# Altium schematic sheet CX3_Camera_Layout.SchDoc
size 508 x 508 mm
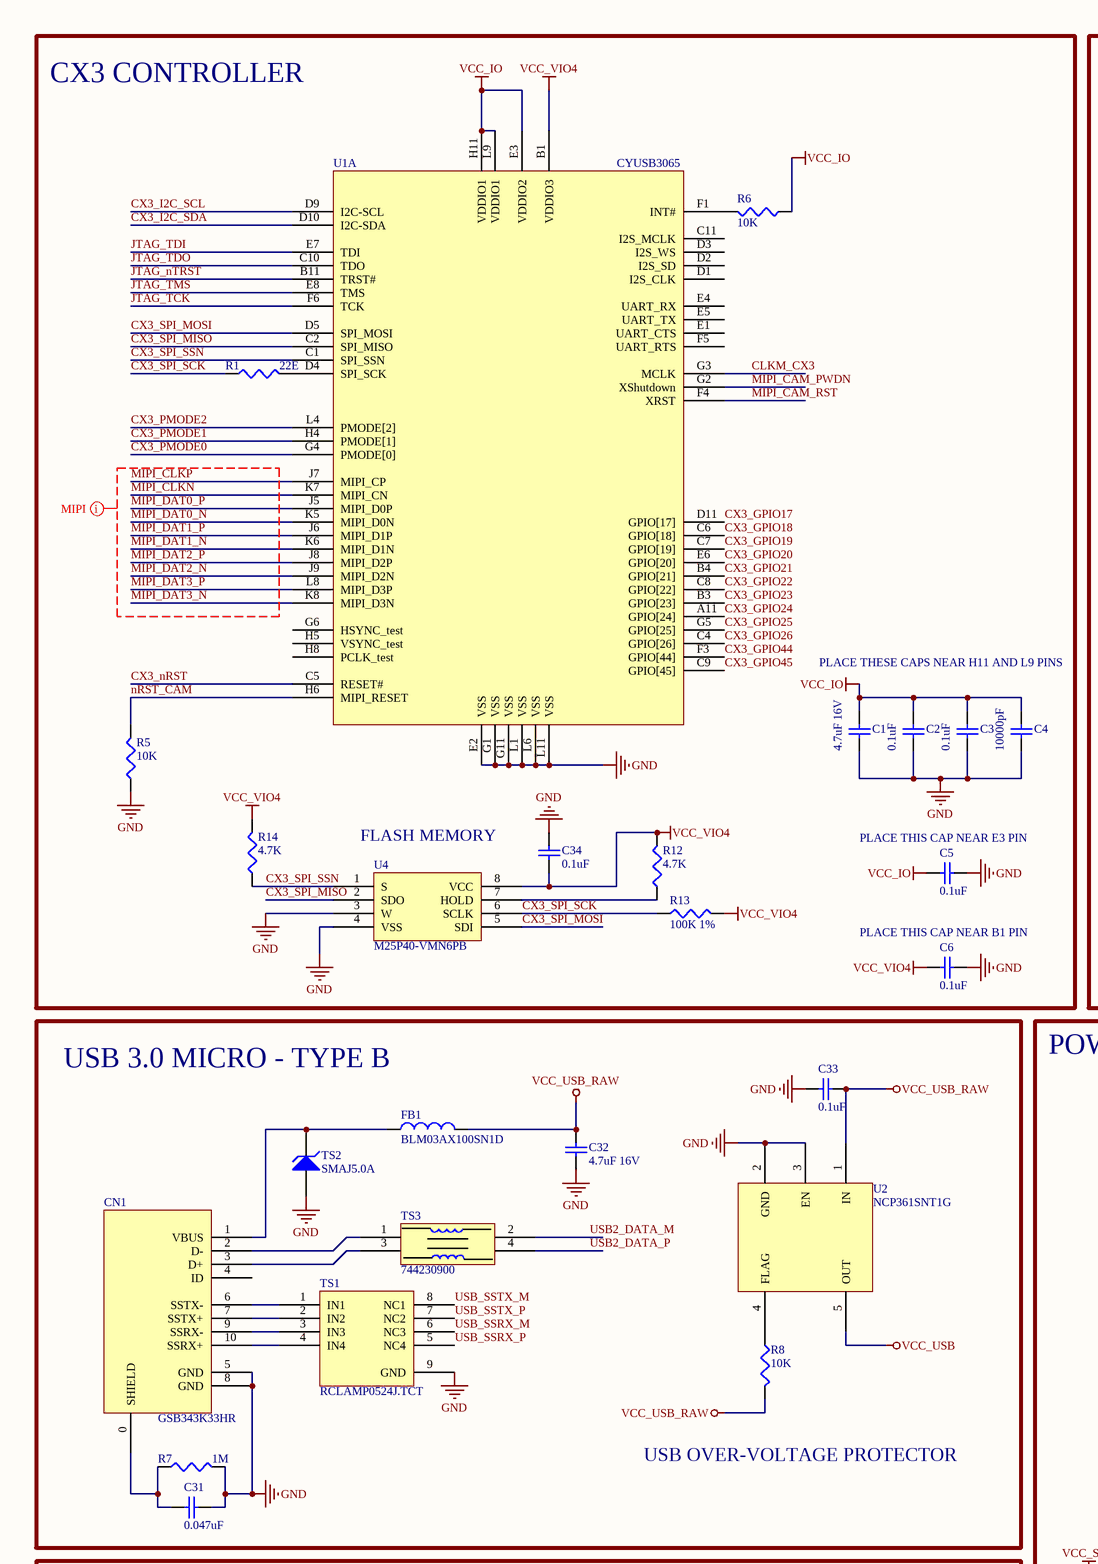
[diagram p0: CX3_Camera_Layout.SchDoc, top left]
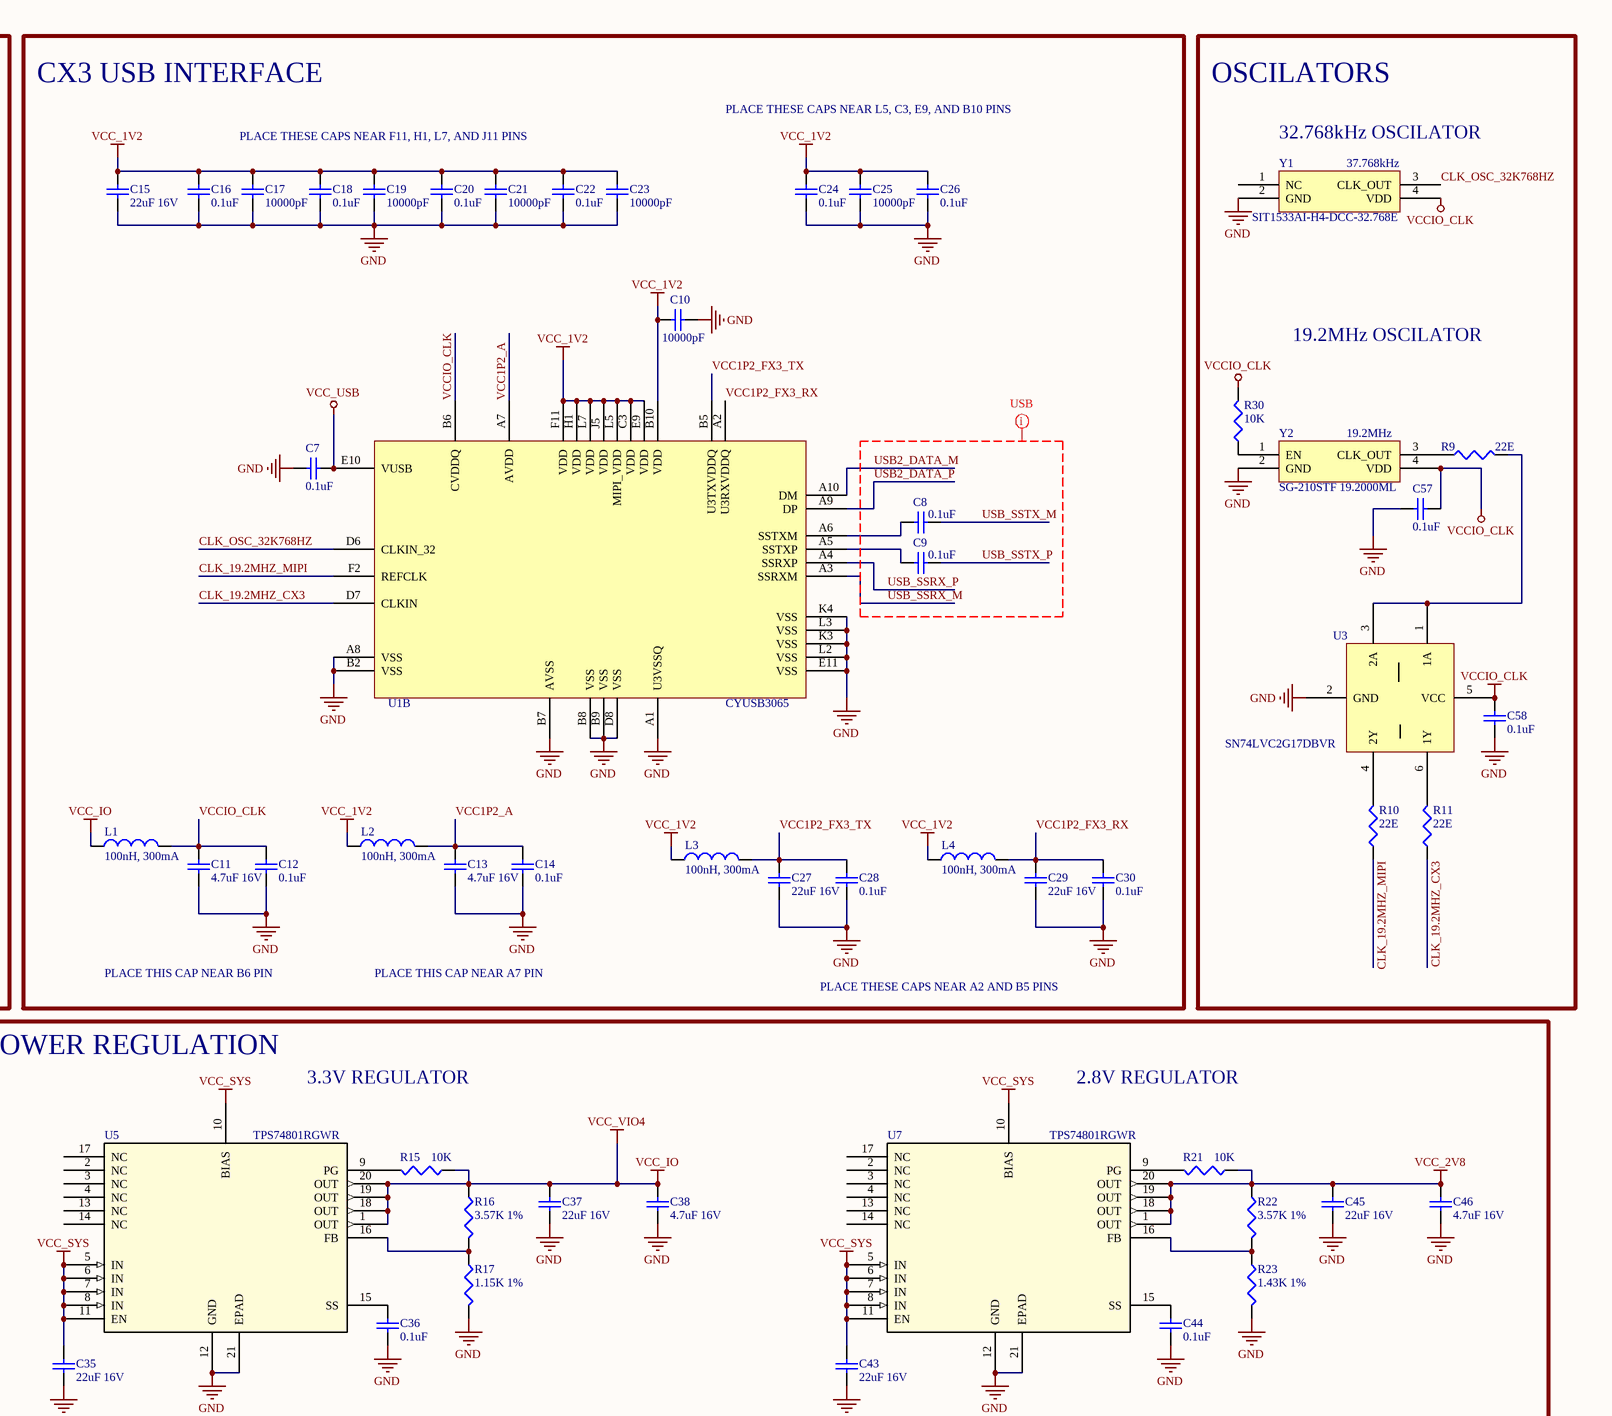
[diagram p1: CX3_Camera_Layout.SchDoc, top right]
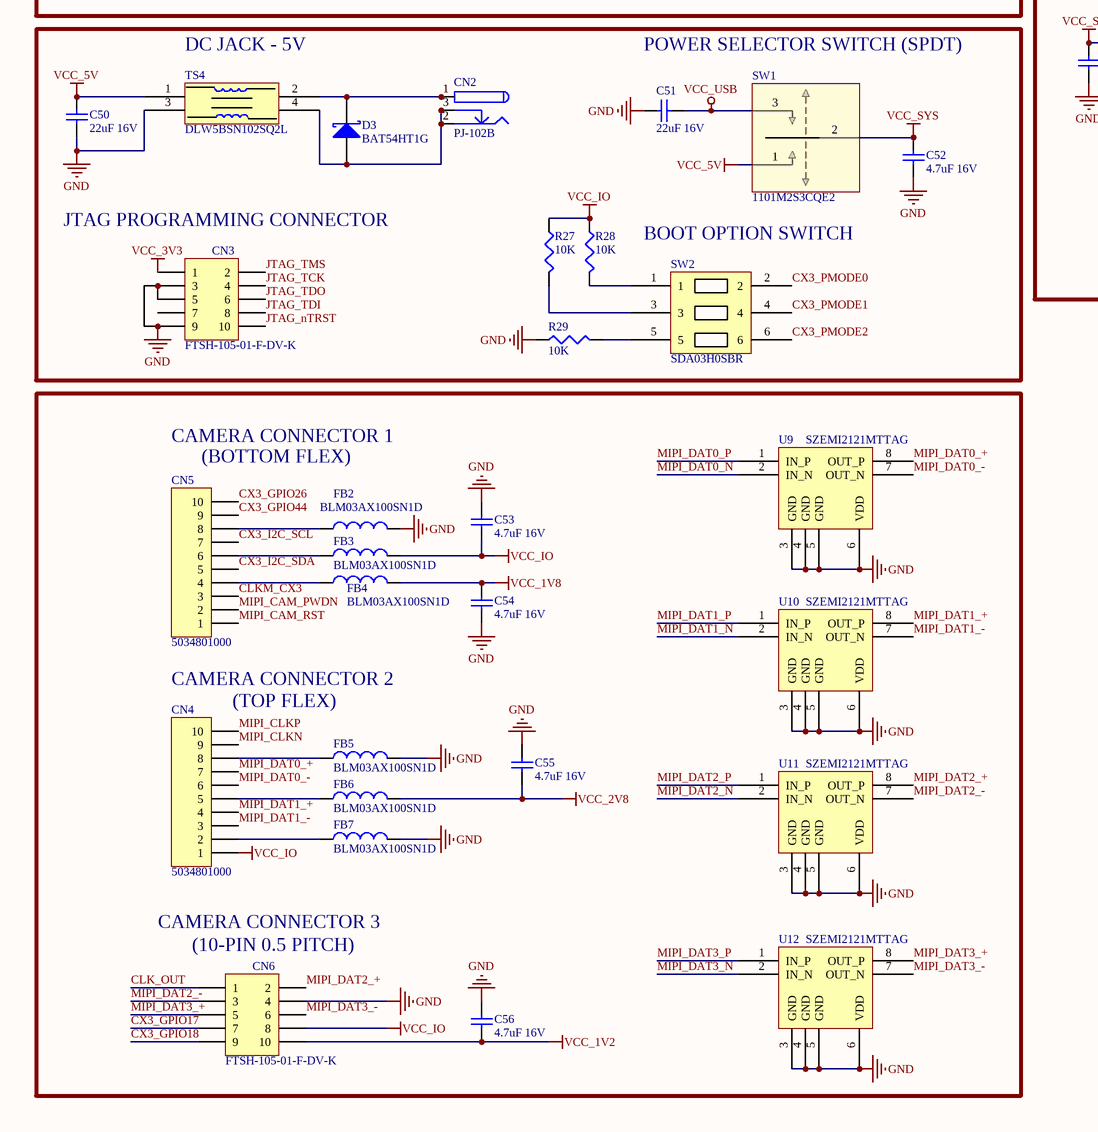
[diagram p2: CX3_Camera_Layout.SchDoc, bottom left]
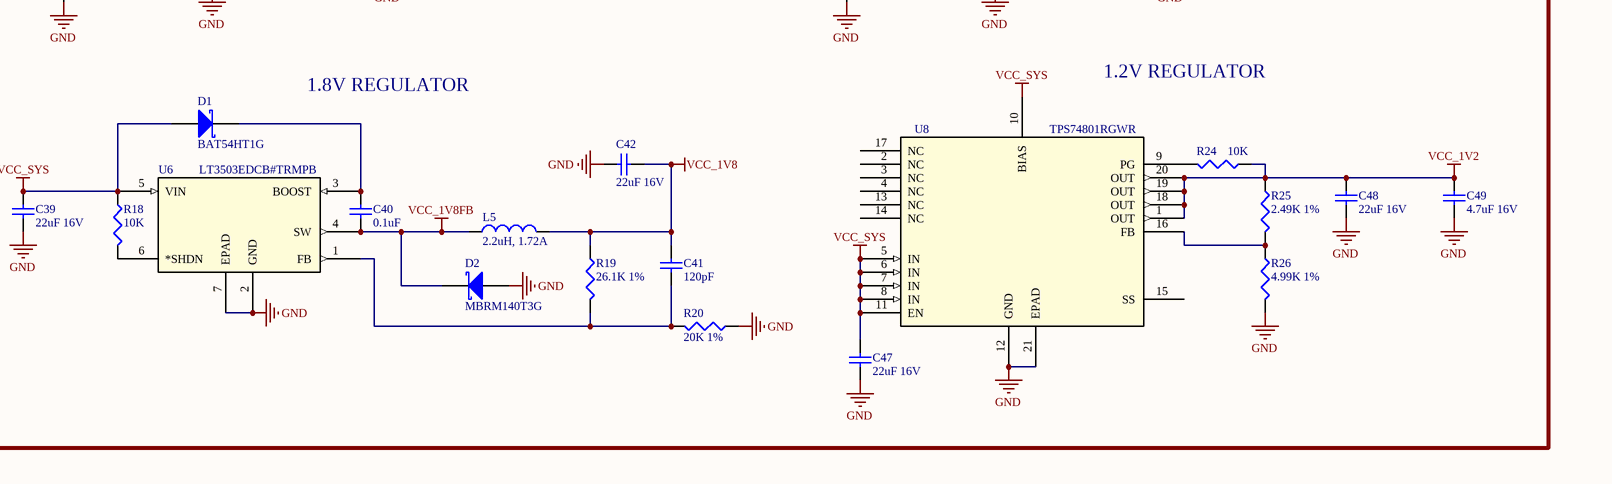
[diagram p3: CX3_Camera_Layout.SchDoc, bottom right]

## Parts
C1  4.7uF 16V  [1608[0603]]
C2  0.1uF  [0402]
C3  0.1uF  [0402]
C4  10000pF  [0402]
C5  0.1uF  [0402]
C6  0.1uF  [0402]
C7  0.1uF  [0402]
C8  0.1uF  [0402]
C9  0.1uF  [0402]
C10  10000pF  [0402]
C11  4.7uF 16V  [1608[0603]]
C12  0.1uF  [0402]
C13  4.7uF 16V  [1608[0603]]
C14  0.1uF  [0402]
C15  22uF 16V  [1608[0603]]
C16  0.1uF  [0402]
C17  10000pF  [0402]
C18  0.1uF  [0402]
C19  10000pF  [0402]
C20  0.1uF  [0402]
C21  10000pF  [0402]
C22  0.1uF  [0402]
C23  10000pF  [0402]
C24  0.1uF  [0402]
C25  10000pF  [0402]
C26  0.1uF  [0402]
C27  22uF 16V  [1608[0603]]
C28  0.1uF  [0402]
C29  22uF 16V  [1608[0603]]
C30  0.1uF  [0402]
C31  0.047uF  [C1210]
C32  4.7uF 16V  [1608[0603]]
C33  0.1uF  [0402]
C34  0.1uF  [0402]
C35  22uF 16V  [1608[0603]]
C36  0.1uF  [0402]
C37  22uF 16V  [1608[0603]]
C38  4.7uF 16V  [1608[0603]]
C39  22uF 16V  [1608[0603]]
C40  0.1uF  [0402]
C41  120pF  [0402]
C42  22uF 16V  [1608[0603]]
C43  22uF 16V  [1608[0603]]
C44  0.1uF  [0402]
C45  22uF 16V  [1608[0603]]
C46  4.7uF 16V  [1608[0603]]
C47  22uF 16V  [1608[0603]]
C48  22uF 16V  [1608[0603]]
C49  4.7uF 16V  [1608[0603]]
C50  22uF 16V  [1608[0603]]
C51  22uF 16V  [C0805]
C52  4.7uF 16V  [C0805]
C53  4.7uF 16V  [1608[0603]]
C54  4.7uF 16V  [1608[0603]]
C55  4.7uF 16V  [1608[0603]]
C56  4.7uF 16V  [1608[0603]]
C57  0.1uF  [0402]
C58  0.1uF  [0402]
CN1  GSB343K33HR  [USB3MicroB]
CN2  PJ-102B  [KLD-0202]
CN3  FTSH-105-01-F-DV-K  [FTSH-105-01-F-DV-K]
CN4  5034801000  [5034801000]
CN5  5034801000  [5034801000]
CN6  FTSH-105-01-F-DV-K  [FTSH-105-01-F-DV-K]
D1  BAT54HT1G  [SOD-323]
D2  MBRM140T3G  [DO-216AA]
D3  BAT54HT1G  [DO-214AC]
FB1  BLM03AX100SN1D  [1608[0603]]
FB2  BLM03AX100SN1D  [0603]
FB3  BLM03AX100SN1D  [0603]
FB4  BLM03AX100SN1D  [0603]
FB5  BLM03AX100SN1D  [0603]
FB6  BLM03AX100SN1D  [0603]
FB7  BLM03AX100SN1D  [0603]
L1  100nH, 300mA  [0603]
L2  100nH, 300mA  [0603]
L3  100nH, 300mA  [0603]
L4  100nH, 300mA  [0603]
L5  2.2uH, 1.72A  [0603]
R1  22E  [0402]
R5  10K  [0402]
R6  10K  [0402]
R7  1M  [0402]
R8  10K  [0402]
R9  22E  [J1-0603]
R10  22E  [0402]
R11  22E  [0402]
R12  4.7K  [0402]
R13  100K 1%  [0402]
R14  4.7K  [0402]
R15  10K  [0402]
R16  3.57K 1%  [0402]
R17  1.15K 1%  [0402]
R18  10K  [0402]
R19  26.1K 1%  [0402]
R20  20K 1%  [0402]
R21  10K  [0402]
R22  3.57K 1%  [0402]
R23  1.43K 1%  [0402]
R24  10K  [0402]
R25  2.49K 1%  [0402]
R26  4.99K 1%  [0402]
R27  10K  [0402]
R28  10K  [0402]
R29  10K  [0402]
R30  10K  [0402]
SW1  1101M2S3CQE2  [1101M2S3CQE2]
SW2  SDA03H0SBR  [SDA03H0SBR]
TS1  RCLAMP0524J.TCT  [RCLAMP0524J]
TS2  SMAJ5.0A  [DO-214AC]
TS3  744230900
TS4  DLW5BSN102SQ2L  [SRF0504-102Y]
U1  CYUSB3065  [BGA121C80P11X11_1000X1000X170B30N]  (parts A,B of 2)
U2  NCP361SNT1G  [SOT-23-5]
U3  SN74LVC2G17DBVR  [SOT-23_A_N]
U4  M25P40-VMN6PB  [SO8_M]
U5  TPS74801RGWR  [RGW20_3P15X3P15]
U6  LT3503EDCB#TRMPB  [DFN-6_DCB]
U7  TPS74801RGWR  [RGW20_3P15X3P15]
U8  TPS74801RGWR  [RGW20_3P15X3P15]
U9  SZEMI2121MTTAG  [SZEMI2121MTTAG]
U10  SZEMI2121MTTAG  [SZEMI2121MTTAG]
U11  SZEMI2121MTTAG  [SZEMI2121MTTAG]
U12  SZEMI2121MTTAG  [SZEMI2121MTTAG]
Y1  SIT1533AI-H4-DCC-32.768E  value 37.768kHz  [SiT1533]
Y2  SG-210STF 19.2000ML  value 19.2MHz  [SG5032]

## Blocks framed on the sheet
CX3 CONTROLLER: C1-C6 C34 R1 R5 R6 R12-R14 U1 U4
CX3 USB INTERFACE: C7-C30 L1-L4 U1
OSCILATORS: C57 C58 R9-R11 R30 U3 Y1 Y2
USB 3.0 MICRO - TYPE B: C31-C33 CN1 FB1 R7 R8 TS1-TS3 U2
POWER REGULATION: C35-C49 D1 D2 L5 R15-R26 U5-U8

## Nets
GND: C1.2 C2.2 C3.2 C4.2 C5.2 C6.2 C7.1 C10.2 C11.1 C12.2 C13.1 C14.2 C15.1 C16.1 C17.1 C18.1 C19.1 C20.1 C21.1 C22.1 C23.1 C24.1 C25.1 C26.1 C27.1 C28.2 C29.1 C30.2 C31.2 C32.1 C33.1 C34.2 C35.1 C36.1 C37.1 C38.1 C39.2 C42.1 C43.1 C44.1 C45.1 C46.1 C47.1 C48.1 C49.1 C50.1 C51.1 C52.1 C53.2 C54.1 C55.2 C56.2 C57.1 C58.2 CN1.5(GND) CN1.8(GND) CN3.3 CN3.5 CN3.9 CN6.4 D2.2(A) FB2.2 FB5.2 FB7.2 R5.1 R7.2 R17.2 R20.1 R23.2 R26.2 R29.1 TS1.9(GND) TS2.1(A) TS4.3 U1.A1(U3VSSQ) U1.A8(VSS) U1.B2(VSS) U1.B7(AVSS) U1.B8(VSS) U1.B9(VSS) U1.D8(VSS) U1.E2(VSS) U1.E11(VSS) U1.G1(VSS) U1.G11(VSS) U1.K3(VSS) U1.K4(VSS) U1.L1(VSS) U1.L2(VSS) U1.L3(VSS) U1.L6(VSS) U1.L11(VSS) U2.2(GND) U2.3(EN) U3.2(GND) U4.3(W) U4.4(VSS) U5.12(GND) U5.21(EPAD) U6.2(GND) U6.7(EPAD) U7.12(GND) U7.21(EPAD) U8.12(GND) U8.21(EPAD) U9.3(GND) U9.4(GND) U9.5(GND) U9.6(VDD) U10.3(GND) U10.4(GND) U10.5(GND) U10.6(VDD) U11.3(GND) U11.4(GND) U11.5(GND) U11.6(VDD) U12.3(GND) U12.4(GND) U12.5(GND) U12.6(VDD) Y1.2(GND) Y2.2(GND)
VCC_1V2: C10.1 C15.2 C16.2 C17.2 C18.2 C19.2 C20.2 C21.2 C22.2 C23.2 C24.2 C25.2 C26.2 C48.2 C49.2 C56.1 CN6.10 L2.1 L3.1 L4.1 R24.1 R25.1 U1.B10(VDD) U1.C3(VDD) U1.E9(VDD) U1.F11(VDD) U1.H1(VDD) U1.J5(VDD) U1.L5(MIPI_VDD) U1.L7(VDD) U8.1(OUT) U8.18(OUT) U8.19(OUT) U8.20(OUT)
VCC_1V8: C41.1 C42.2 C54.2 FB4.2 L5.2 R19.1
VCC_1V8FB: C40.2 D2.1(K) L5.1 U6.4(SW)
VCC_2V8: C45.2 C46.2 C55.1 FB6.2 R21.1 R22.1 U7.1(OUT) U7.18(OUT) U7.19(OUT) U7.20(OUT)
VCC_3V3: CN3.1
VCC_5V: C50.2 SW1.1 TS4.1
VCC_IO: C1.1 C2.1 C3.1 C4.1 C5.1 C6.1 C34.1 C37.2 C38.2 C53.1 CN4.1 CN6.8 FB3.2 L1.1 R6.1 R12.2 R13.2 R14.2 R15.1 R16.1 R27.1 R28.1 U1.B1(VDDIO3) U1.E3(VDDIO2) U1.H11(VDDIO1) U1.L9(VDDIO1) U4.8(VCC) U5.1(OUT) U5.18(OUT) U5.19(OUT) U5.20(OUT)  [also labelled VCC_VIO4]
VCC_SYS: C35.2 C39.1 C43.2 C47.2 C52.2 D1.2(A) R18.1 SW1.2 U5.5(IN) U5.6(IN) U5.7(IN) U5.8(IN) U5.10(BIAS) U5.11(EN) U6.5(VIN) U7.5(IN) U7.6(IN) U7.7(IN) U7.8(IN) U7.10(BIAS) U7.11(EN) U8.5(IN) U8.6(IN) U8.7(IN) U8.8(IN) U8.10(BIAS) U8.11(EN)
VCC_USB: C7.2 C51.2 SW1.3 U1.E10(VUSB) U2.5(OUT)
VCC_USB_RAW: C32.2 C33.2 FB1.2 R8.2 U2.1(IN)
VCCIO_CLK: C11.2 C12.1 C57.2 C58.1 L1.2 R30.2 U1.B6(CVDDQ) U3.5(VCC) Y1.4(VDD) Y2.4(VDD)
CLK_19.2MHZ_CX3: R11.1 U1.D7(CLKIN)
CLK_19.2MHZ_MIPI: R10.1 U1.F2(REFCLK)
CLK_OSC_32K768HZ: U1.D6(CLKIN_32) Y1.3(CLK_OUT)
CLK_OUT: CN6.1
CLKM_CX3: CN5.3 U1.G3(MCLK)
CX3_GPIO17: CN6.7 U1.D11(GPIO[17])
CX3_GPIO18: CN6.9 U1.C6(GPIO[18])
CX3_GPIO19: U1.C7(GPIO[19])
CX3_GPIO20: U1.E6(GPIO[20])
CX3_GPIO21: U1.B4(GPIO[21])
CX3_GPIO22: U1.C8(GPIO[22])
CX3_GPIO23: U1.B3(GPIO[23])
CX3_GPIO24: U1.A11(GPIO[24])
CX3_GPIO25: U1.G5(GPIO[25])
CX3_GPIO26: CN5.10 U1.C4(GPIO[26])
CX3_GPIO44: CN5.9 U1.F3(GPIO[44])
CX3_GPIO45: U1.C9(GPIO[45])
CX3_I2C_SCL: CN5.7 U1.D9(I2C-SCL)
CX3_I2C_SDA: CN5.5 U1.D10(I2C-SDA)
CX3_nRST: U1.C5(RESET#)
CX3_PMODE0: SW2.2 U1.G4(PMODE[0])
CX3_PMODE1: SW2.4 U1.H4(PMODE[1])
CX3_PMODE2: SW2.6 U1.L4(PMODE[2])
CX3_SPI_MISO: U1.C2(SPI_MISO) U4.2(SDO)
CX3_SPI_MOSI: U1.D5(SPI_MOSI) U4.5(SDI)
CX3_SPI_SCK: R1.1 R13.1 U4.6(SCLK)
CX3_SPI_SSN: R14.1 U1.C1(SPI_SSN) U4.1(S)
JTAG_nTRST: CN3.10 U1.B11(TRST#)
JTAG_TCK: CN3.4 U1.F6(TCK)
JTAG_TDI: CN3.8 U1.E7(TDI)
JTAG_TDO: CN3.6 U1.C10(TDO)
JTAG_TMS: CN3.2 U1.E8(TMS)
MIPI_CAM_PWDN: CN5.2 U1.G2(XShutdown)
MIPI_CAM_RST: CN5.1 U1.F4(XRST)
MIPI_CLKN: CN4.9 U1.K7(MIPI_CN)
MIPI_CLKP: CN4.10 U1.J7(MIPI_CP)
MIPI_DAT0_+: CN4.7 U9.8(OUT_P)
MIPI_DAT0_-: CN4.6 U9.7(OUT_N)
MIPI_DAT0_N: U1.K5(MIPI_D0N) U9.2(IN_N)
MIPI_DAT0_P: U1.J5(MIPI_D0P) U9.1(IN_P)
MIPI_DAT1_+: CN4.4 U10.8(OUT_P)
MIPI_DAT1_-: CN4.3 U10.7(OUT_N)
MIPI_DAT1_N: U1.K6(MIPI_D1N) U10.2(IN_N)
MIPI_DAT1_P: U1.J6(MIPI_D1P) U10.1(IN_P)
MIPI_DAT2_+: CN6.2 U11.8(OUT_P)
MIPI_DAT2_-: CN6.3 U11.7(OUT_N)
MIPI_DAT2_N: U1.J9(MIPI_D2N) U11.2(IN_N)
MIPI_DAT2_P: U1.J8(MIPI_D2P) U11.1(IN_P)
MIPI_DAT3_+: CN6.5 U12.8(OUT_P)
MIPI_DAT3_-: CN6.6 U12.7(OUT_N)
MIPI_DAT3_N: U1.K8(MIPI_D3N) U12.2(IN_N)
MIPI_DAT3_P: U1.L8(MIPI_D3P) U12.1(IN_P)
nRST_CAM: R5.2 U1.H6(MIPI_RESET)
USB2_DATA_M: TS3.2 U1.A10(DM)
USB2_DATA_P: TS3.4 U1.A9(DP)
USB_SSRX_M: TS1.6(NC3) U1.A3(SSRXM)
USB_SSRX_P: TS1.5(NC4) U1.A4(SSRXP)
USB_SSTX_M: C8.2 TS1.8(NC1)
USB_SSTX_P: C9.2 TS1.7(NC2)
VCC1P2_A: C13.2 C14.1 L2.2 U1.A7(AVDD)
VCC1P2_FX3_RX: C29.2 C30.1 L4.2 U1.A2(U3RXVDDQ)
VCC1P2_FX3_TX: C27.2 C28.1 L3.2 U1.B5(U3TXVDDQ)
NetC8_1: C8.1 U1.A6(SSTXM)
NetC9_1: C9.1 U1.A5(SSTXP)
NetC31_1: C31.1 CN1.0(SHIELD) R7.1
NetC36_2: C36.2 U5.15(SS)
NetC40_1: C40.1 D1.1(K) U6.3(BOOST)
NetC41_2: C41.2 R19.2 R20.2 U6.1(FB)
NetC44_2: C44.2 U7.15(SS)
NetCN1_1: CN1.1(VBUS) FB1.1 TS2.2(K)
NetCN1_2: CN1.2(D-) TS3.1
NetCN1_3: CN1.3(D+) TS3.3
NetCN1_6: CN1.6(SSTX-) TS1.1(IN1)
NetCN1_7: CN1.7(SSTX+) TS1.2(IN2)
NetCN1_9: CN1.9(SSRX-) TS1.3(IN3)
NetCN1_10: CN1.10(SSRX+) TS1.4(IN4)
NetCN2_1: CN2.1 CN2.1A CN2.1B D3.1(K) TS4.2
NetCN2_2: CN2.2 CN2.2A CN2.2B CN2.3 CN2.3A CN2.3B D3.2(A) TS4.4
NetCN4_2: CN4.2 FB7.1
NetCN4_5: CN4.5 FB6.1
NetCN4_8: CN4.8 FB5.1
NetCN5_4: CN5.4 FB4.1
NetCN5_6: CN5.6 FB3.1
NetCN5_8: CN5.8 FB2.1
NetR1_2: R1.2 U1.D4(SPI_SCK)
NetR6_2: R6.2 U1.F1(INT#)
NetR8_1: R8.1 U2.4(FLAG)
NetR9_1: R9.1 Y2.3(CLK_OUT)
NetR9_2: R9.2 U3.1(1A) U3.3(2A)
NetR10_2: R10.2 U3.4(2Y)
NetR11_2: R11.2 U3.6(1Y)
NetR12_1: R12.1 U4.7(HOLD)
NetR15_2: R15.2 U5.9(PG)
NetR16_2: R16.2 R17.1 U5.16(FB)
NetR18_2: R18.2 U6.6(*SHDN)
NetR21_2: R21.2 U7.9(PG)
NetR22_2: R22.2 R23.1 U7.16(FB)
NetR24_2: R24.2 U8.9(PG)
NetR25_2: R25.2 R26.1 U8.16(FB)
NetR27_2: R27.2 SW2.3
NetR28_2: R28.2 SW2.1
NetR29_2: R29.2 SW2.5
NetR30_1: R30.1 Y2.1(EN)

Not connected (* = marked no-connect by the designer): CN1 4(ID); CN3 7; U1 C11(I2S_MCLK) D1(I2S_CLK) D2(I2S_SD) D3(I2S_WS) E1(UART_CTS) E4(UART_RX) E5(UART_TX) F5(UART_RTS) G6(HSYNC_test) H5(VSYNC_test) H8(PCLK_test); U5 2(NC) 3(NC) 4(NC) 13(NC) 14(NC) 17(NC); U7 2(NC) 3(NC) 4(NC) 13(NC) 14(NC) 17(NC); U8 2(NC) 3(NC) 4(NC) 13(NC) 14(NC) 15(SS) 17(NC); Y1 1(NC)

## Layout directives
net class USB: USB2_DATA_M, USB2_DATA_P, USB_SSRX_M, USB_SSRX_P, USB_SSTX_M, USB_SSTX_P
net class MIPI: MIPI_CLKN, MIPI_CLKP, MIPI_DAT0_N, MIPI_DAT0_P, MIPI_DAT1_N, MIPI_DAT1_P, MIPI_DAT2_N, MIPI_DAT2_P, MIPI_DAT3_N, MIPI_DAT3_P

## Notes on the sheet
- PLACE THESE CAPS NEAR F11, H1, L7, AND J11 PINS
- PLACE THESE CAPS NEAR L5, C3, E9, AND B10 PINS
- (near Y1) 32.768kHz OSCILATOR
- 19.2MHz OSCILATOR
- PLACE THESE CAPS NEAR H11 AND L9 PINS
- (near U4) FLASH MEMORY
- (near C5) PLACE THIS CAP NEAR E3 PIN
- (near C6) PLACE THIS CAP NEAR B1 PIN
- PLACE THIS CAP NEAR B6 PIN
- PLACE THIS CAP NEAR A7 PIN
- PLACE THESE CAPS NEAR A2 AND B5 PINS
- 3.3V REGULATOR
- 2.8V REGULATOR
- USB OVER-VOLTAGE PROTECTOR
- 1.8V REGULATOR
- 1.2V REGULATOR
- DC JACK - 5V
- POWER SELECTOR SWITCH (SPDT)
- (near CN3) JTAG PROGRAMMING CONNECTOR
- BOOT OPTION SWITCH
- CAMERA CONNECTOR 1
- (near CN5) (BOTTOM FLEX)
- CAMERA CONNECTOR 2
- (near CN4) (TOP FLEX)
- CAMERA CONNECTOR 3
- (near CN6) (10-PIN 0.5 PITCH)

## Library data of the parts
C1 C11 C13 C32 C38 C46 C49 C52-C56 = Cap Semi: Capacitor (Semiconductor SIM Model); Published: 8-Jun-2000; LatestRevisionDate: 29-May-2009; LatestRevisionNote: IPC-7351 Footprint Added.; PackageReference: C1206; Publisher: Altium Limited; PackageDescription: Chip Capacitor; Value: 4.7uF
C2-C10 C12 C14-C31 C33-C37 C39-C45 C47 C48 C50 C51 C57 C58 = Cap Semi: Capacitor (Semiconductor SIM Model); Value: 4.7uF; Published: 8-Jun-2000; LatestRevisionDate: 29-May-2009; LatestRevisionNote: IPC-7351 Footprint Added.; PackageReference: C1206; Publisher: Altium Limited; PackageDescription: Chip Capacitor
CN2 = PWR2.5: Low Voltage Power Supply Connector; Published: 17-Dec-2003; DatasheetDocument: 09-May-2002; Publisher: Altium Limited; ComponentLink1Description: Manufacturer Link; ComponentLink1URL: http://domino.kycon.com/internet/Products.html
CN3 CN6 = MHDR2X5: Header, 5-Pin, Dual row; LatestRevisionDate: 17-Jul-2002; LatestRevisionNote: Re-released for DXP Platform.; Publisher: Altium Limited
CN4 CN5 = Header 10: Header, 10-Pin; LatestRevisionDate: 17-Jul-2002; LatestRevisionNote: Re-released for DXP Platform.; Publisher: Altium Limited
D1-D3 = BAT60B: Silicon AF Schottky Rectifier Diode; Published: 21-Mar-2003; LatestRevisionDate: 19-Mar-2004; LatestRevisionNote: Silkscreen size reduced.; DatasheetDocument: Jan-1999; PackageDocument: Sep-2000; PackageReference: SOD-323; Publisher: Altium Limited; ComponentLink1Description: Manufacturer Link; ComponentLink1URL: http://www.infineon.com/; ComponentLink2Description: Datasheet; ComponentLink2URL: http://www.infineon.com/upload/Document/cmc_upload/documents/009/394/bat60bseries.pdf
FB1-FB7 L1-L5 = Inductor: Code_IEC: 1005; Value: 10mH; Published: 8-Jun-2000; LatestRevisionDate: 29-May-2009; LatestRevisionNote: IPC-7351 Footprint Added.; PackageReference: 0402-A; Publisher: Altium Limited; PackageDescription: Chip Inductor; Code_JEITA: 0402
R1 R8-R11 = Res3: Resistor; Published: 8-Jun-2000; LatestRevisionDate: 29-May-2009; LatestRevisionNote: IPC-7351 Footprint Added.; PackageReference: J1-0603; Publisher: Altium Limited; PackageDescription: Chip Resistor
  R1 R9-R11: Value: 22E
  R8: Value: 10K
R5-R7 R12-R30 = Res3: Resistor; Value: 22E; Published: 8-Jun-2000; LatestRevisionDate: 29-May-2009; LatestRevisionNote: IPC-7351 Footprint Added.; PackageReference: J1-0603; Publisher: Altium Limited; PackageDescription: Chip Resistor
SW1 = 1101M2S3CQE2: Imported; Vendor: C&K; C: Copyright (C) 2015 Accelerated Designs. All rights reserved; Manufacturer_Part_Number: 1101M2S3CQE2; Copyright: Copyright (C) 2015 Accelerated Designs. All rights reserved; RefDes: RefDes; Type: Type; Value: Value
TS1 = RCLAMP0524J
TS2 = DL5243B: Silicon Zener Diode; Published: 8-Jun-2000; LatestRevisionDate: 19-Mar-2004; LatestRevisionNote: Silkscreen size reduced.; PackageReference: DL-35; Publisher: Altium Limited; ComponentLink1Description: Manufacturer Link; ComponentLink1URL: http://www.vishay.com/
TS3 TS4 = CHOKE_COM
U1 = CYUSB3065: Cypress CX3
U4 = M25P40
U5 U7 U8 = TPS74801RGWR: Imported; Vendor: Texas Instruments; PACKAGE_DESIGNATOR: RGW; PIN_COUNT: 20; FAMILY_NAME: SINGLE CHANNEL LDO; INDUSTRY_STD_PKG_TYPE: VQFN; 3D_Library_Name: TI_AllParts_2012-12-25; C: Copyright (C) 2015 Accelerated Designs. All rights reserved; Manufacturer_Part_Number: TPS74801RGWR; GENERIC_PART_NUMBER: TPS74801; Copyright: Copyright (C) 2015 Accelerated Designs. All rights reserved; Datasheet_URL: http://www.ti.com/lit/gpn/TPS74801; Manufacturer: Texas Instruments; Value: Value; Type: Type; RefDes: RefDes
U6 = LT3503EDCB#TRMPB: Imported; Manufacturer_Part_Number: lt3503edcb#trmpbf; Vendor: Linear Technology; C: Copyright (C) 2016 Accelerated Designs. All rights reserved; Copyright: Copyright (C) 2016 Accelerated Designs. All rights reserved; Value: Value; Type: Type; RefDes: RefDes
Y1 = OSCILATOR_32kHz
Y2 = OSCILLATOR